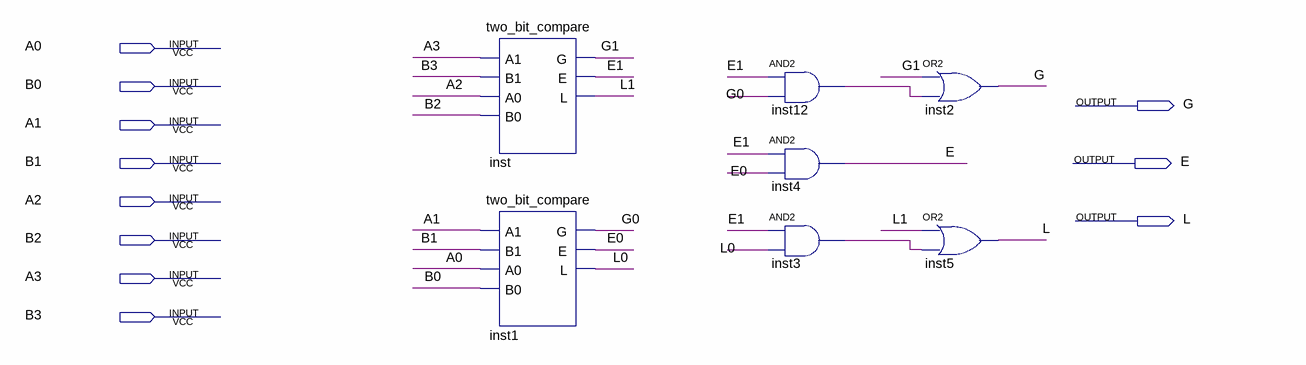
[diagram p0: schematic sheet]
// Quartus schematic four_bit_compare.bdf as structural Verilog: 7 symbols, 11 pins
module four_bit_compare (
  input  A0,
  input  B0,
  input  A1,
  input  B1,
  input  A2,
  input  B2,
  input  A3,
  input  B3,
  output G,
  output E,
  output L
);

  wire E0, E1, G0, G1, inst3_out, inst12_out, L0, L1;

  two_bit_compare inst (.A1(A3), .B1(B3), .A0(A2), .B0(B2), .G(G1), .E(E1), .L(L1));
  two_bit_compare inst1 (.A1(A1), .B1(B1), .A0(A0), .B0(B0), .G(G0), .E(E0), .L(L0));
  and inst12 (inst12_out, E1, G0);
  and inst4 (E, E1, E0);
  and inst3 (inst3_out, E1, L0);
  or inst2 (G, G1, inst12_out);
  or inst5 (L, L1, inst3_out);
endmodule
